# EAGLE design fca (EAGLE 9.6.1)
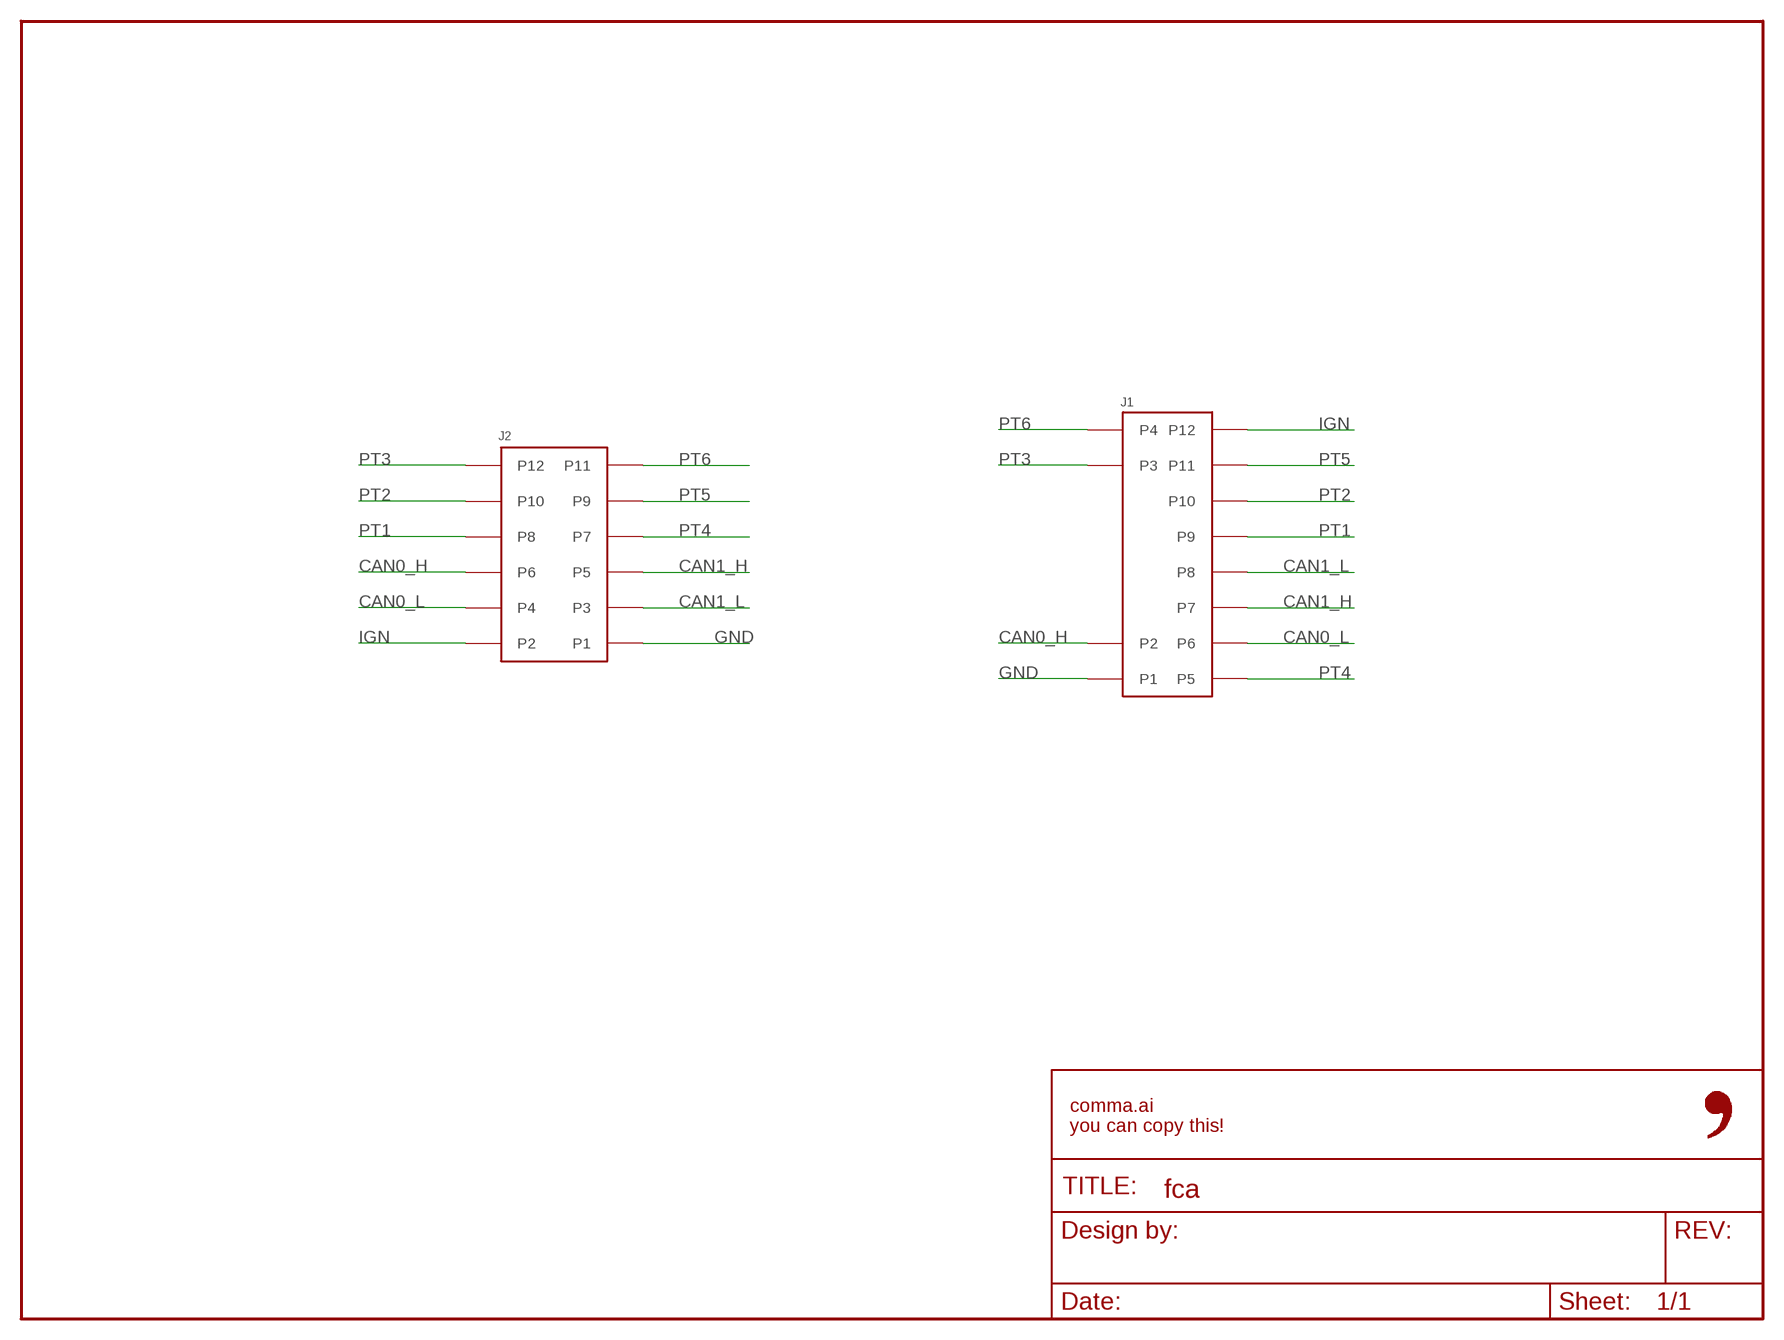
[diagram p0: schematic, sheet 1]

## Parts
FRAME1  FRAME-LETTER-OPENNO_PACKAGE  [DUMMY]
J1  0348260124  [0348260124]
J2  5018761240  [5018761240]

## Nets
CAN0_H: J1.P2 J2.P6
CAN0_L: J1.P6 J2.P4
CAN1_H: J1.P7 J2.P5
CAN1_L: J1.P8 J2.P3
GND: J1.P1 J2.P1
IGN: J1.P12 J2.P2
PT1: J1.P9 J2.P8
PT2: J1.P10 J2.P10
PT3: J1.P3 J2.P12
PT4: J1.P5 J2.P7
PT5: J1.P11 J2.P9
PT6: J1.P4 J2.P11

## Library data of the parts
FRAME1 = comma.ai:FRAME-LETTER-OPEN: Schematic Frame - Letter Standard 8.5x11 US Letter frame; DESIGNER: Nobody; VERSION: v01
J1 = 0348240124:0348260124; CPN: CAI-HARNESS-MOLEX-0348260124; MPN: 0348260124
J2 = 5018761440:5018761240; CPN: CAI-HARNESS-MOLEX-5018761240; MPN: 5018761240

## Board
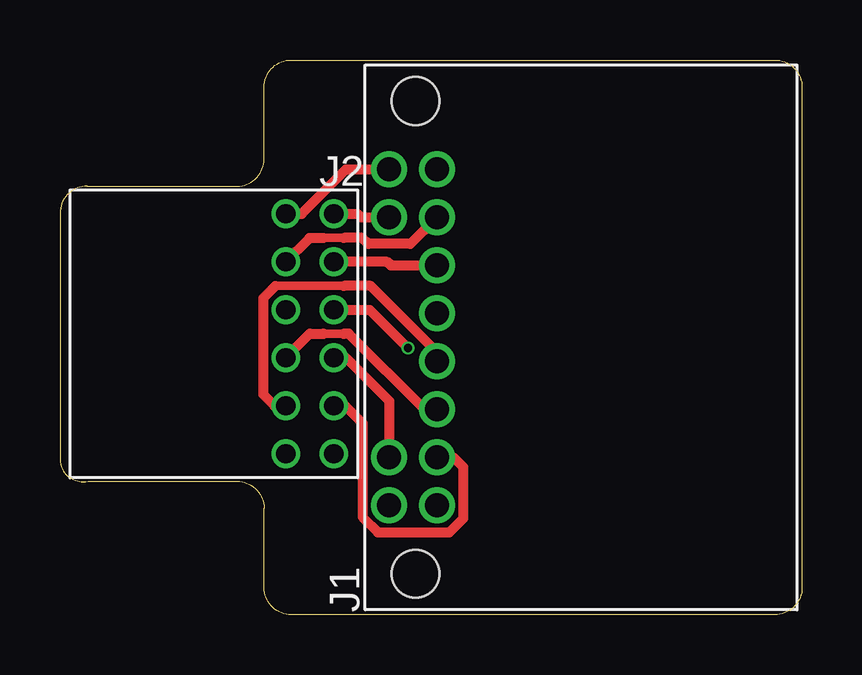
[diagram p1: board, top side]
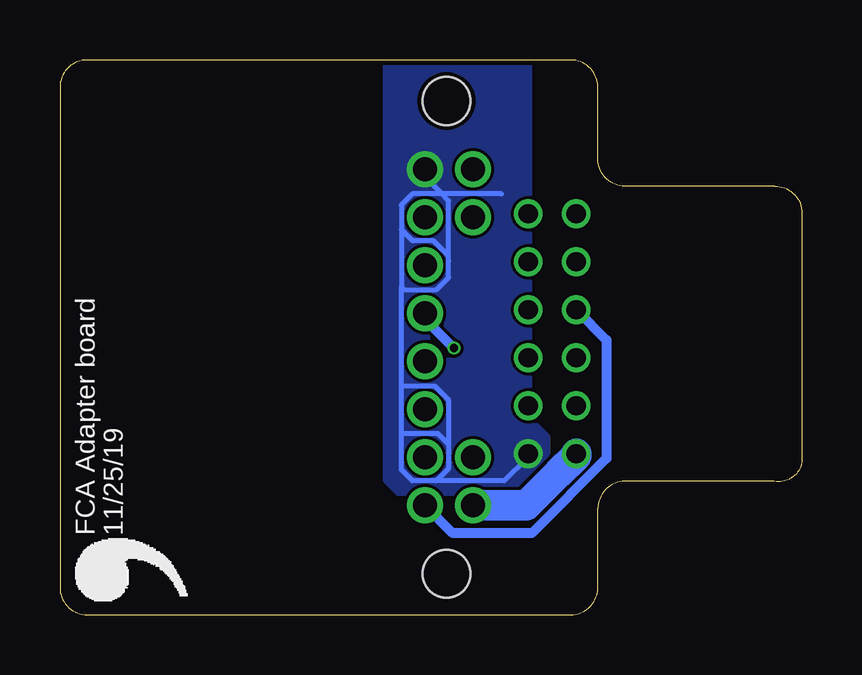
[diagram p2: board, bottom side, seen from below]

Size 30.94 x 23.11 mm. Coordinates in mm from the lower left corner, seen from the top.
Outline: 1.17,5.56 7.38,5.56 arc-90 8.51,4.43 8.51,1.13 arc90 9.64,0 29.81,0 arc90 30.94,1.13 30.94,21.98 arc90 29.81,23.11 9.64,23.11 arc90 8.51,21.98 8.51,18.99 arc-90 7.38,17.86 1.14,17.86 arc90 0,16.74 0,6.35 arc90 1.17,5.56
Copper layers (1*16): Top 0.035mm / dielectric 1.5mm / Bottom 0.035mm
Design rules "jlcpcb_2layer": minimum track width 5mil, minimum drill 12mil, track to track 5mil, track to pad 5mil, pad to pad 5mil, via to via 5mil, smd to smd 5mil, copper to edge 8mil, drill to drill 8mil, minimum pad ring 3mil, minimum via ring 3mil, stop-mask expansion 4mm, vias tented up to drill 20mil, thermal gap 10mil

### Footprints (pad centres in the part's own frame; a part is rotated, then mirrored left to right if it is on the bottom)
0348260124 = drill 1: P1 -7,2; P2 -5,2; P3 5,2; P4 7,2; P5 -7,0; P6 -5,0; P7 -3,0; P8 -1,0; P9 1,0; P10 3,0; P11 5,0; P12 7,0 | hole 2: -9.85,0.9; 9.85,0.9
5018761240 = drill 0.8: P1 5,-1; P2 5,1; P3 3,-1; P4 3,1; P5 1,-1; P6 1,1; P7 -1,-1; P8 -1,1; P9 -3,-1; P10 -3,1; P11 -5,-1; P12 -5,1

### Placement (x,y rotation side)
FRAME1  -0.61,-1.85 0 top
J1  15.72,11.56 90 top
J2  10.41,11.71 270 top
U$1  [LOGO]  25.32,-0.1 90 bottom

### Tracks (layer width: path | path; a pad name or v marks a point on that pad's centre or on a via)
CAN0_H
  Top 0.406: J2.P6 11.92,10.71 13.72,8.91 J1.P2
CAN0_L
  Top 0.406: J2.P4 11.89,8.71 12.62,7.98 12.62,4.06 13.26,3.43 16.23,3.43 16.82,4.01 16.82,6.15 16.41,6.56 J1.P6
CAN1_H
  Top 0.356: 11.84,11.71 10.99,11.71
  Top 0.406: J2.P5 10.42,11.71 10.98,11.71 10.99,11.71 | 11.84,11.71 12.04,11.71 15.19,8.56 J1.P7
CAN1_L
  Top 0.356: 11.84,13.71 8.99,13.71
  Top 0.406: 8.99,13.71 8.48,13.2 8.48,9.17 8.95,8.71 J2.P3 | J1.P8 15.72,10.94 12.95,13.71 11.84,13.71
GND
  Bottom 1.27: J2.P1 9.41,6.63 10.18,5.87 11.49,4.56 J1.P1
IGN
  Bottom 0.203: J1.P12 15.72,18.24 15.02,17.54 | 15,17.52 14.73,17.25 14.73,14.73 | 15.02,17.54 12.53,17.54 12.52,17.53 | J2.P2 11.41,6.59 12.43,5.58 15.24,5.58 | 15.24,5.58 16.25,5.58 16.7,6.03 16.7,7.54 | 16.7,9.46 16.63,9.54 15.32,9.54 14.74,8.96 14.74,7.11 | 16.7,7.54 16.7,9.46 | 14.74,7.11 14.74,6.07 15.24,5.58 | 16.7,9.46 16.7,13.65 | 14.73,14.73 14.73,14.05 15.24,13.54 16.58,13.54 16.7,13.65 | 16.7,16.05 16.23,15.58 15.36,15.58 14.74,14.96 14.74,14.74 14.73,14.73 | 16.7,16.05 16.7,13.65 | 15.02,17.54 16.25,17.54 16.7,17.08 16.7,16.05 | 14.74,7.11 15.18,7.54 16.7,7.54
  pour Bottom (no thermals): 17.35,23.32 11.38,23.32 11.38,8.18 10.64,7.44 10.64,6.68 12.27,5.05 16.81,5.05 17.35,5.59
PT1  (via drill 0.35)
  Top 0.406: J2.P8 12.91,12.71 v14.51,11.11
  Bottom 0.406: v14.51,11.11 15.72,12.32 J1.P9
PT2
  Top 0.406: J1.P10 13.79,14.56 13.64,14.71 J2.P10 | J2.P10
PT3
  Top 0.406: J2.P12 12.4,16.71 12.55,16.56 J1.P3
PT4
  Bottom 0.406: J2.P7 8.15,11.45 8.15,6.52 11.27,3.4 14.57,3.4 J1.P5
PT5
  Top 0.356: 11.84,15.71 10.99,15.71 10.98,15.7
  Top 0.406: J2.P9 10.4,15.7 10.98,15.7 | 11.84,15.71 12.6,15.71 12.86,15.45 14.61,15.45 15.2,16.04 J1.P11
PT6
  Top 0.406: J2.P11 10.07,16.71 11.92,18.56 J1.P4

### Text on the board
bNames: 11/25/19 | FCA Adapter board